# Altium schematic sheet analog_Project_schematic_1.SchDoc
size A4; SheetNumber: 1; SheetTotal: 2
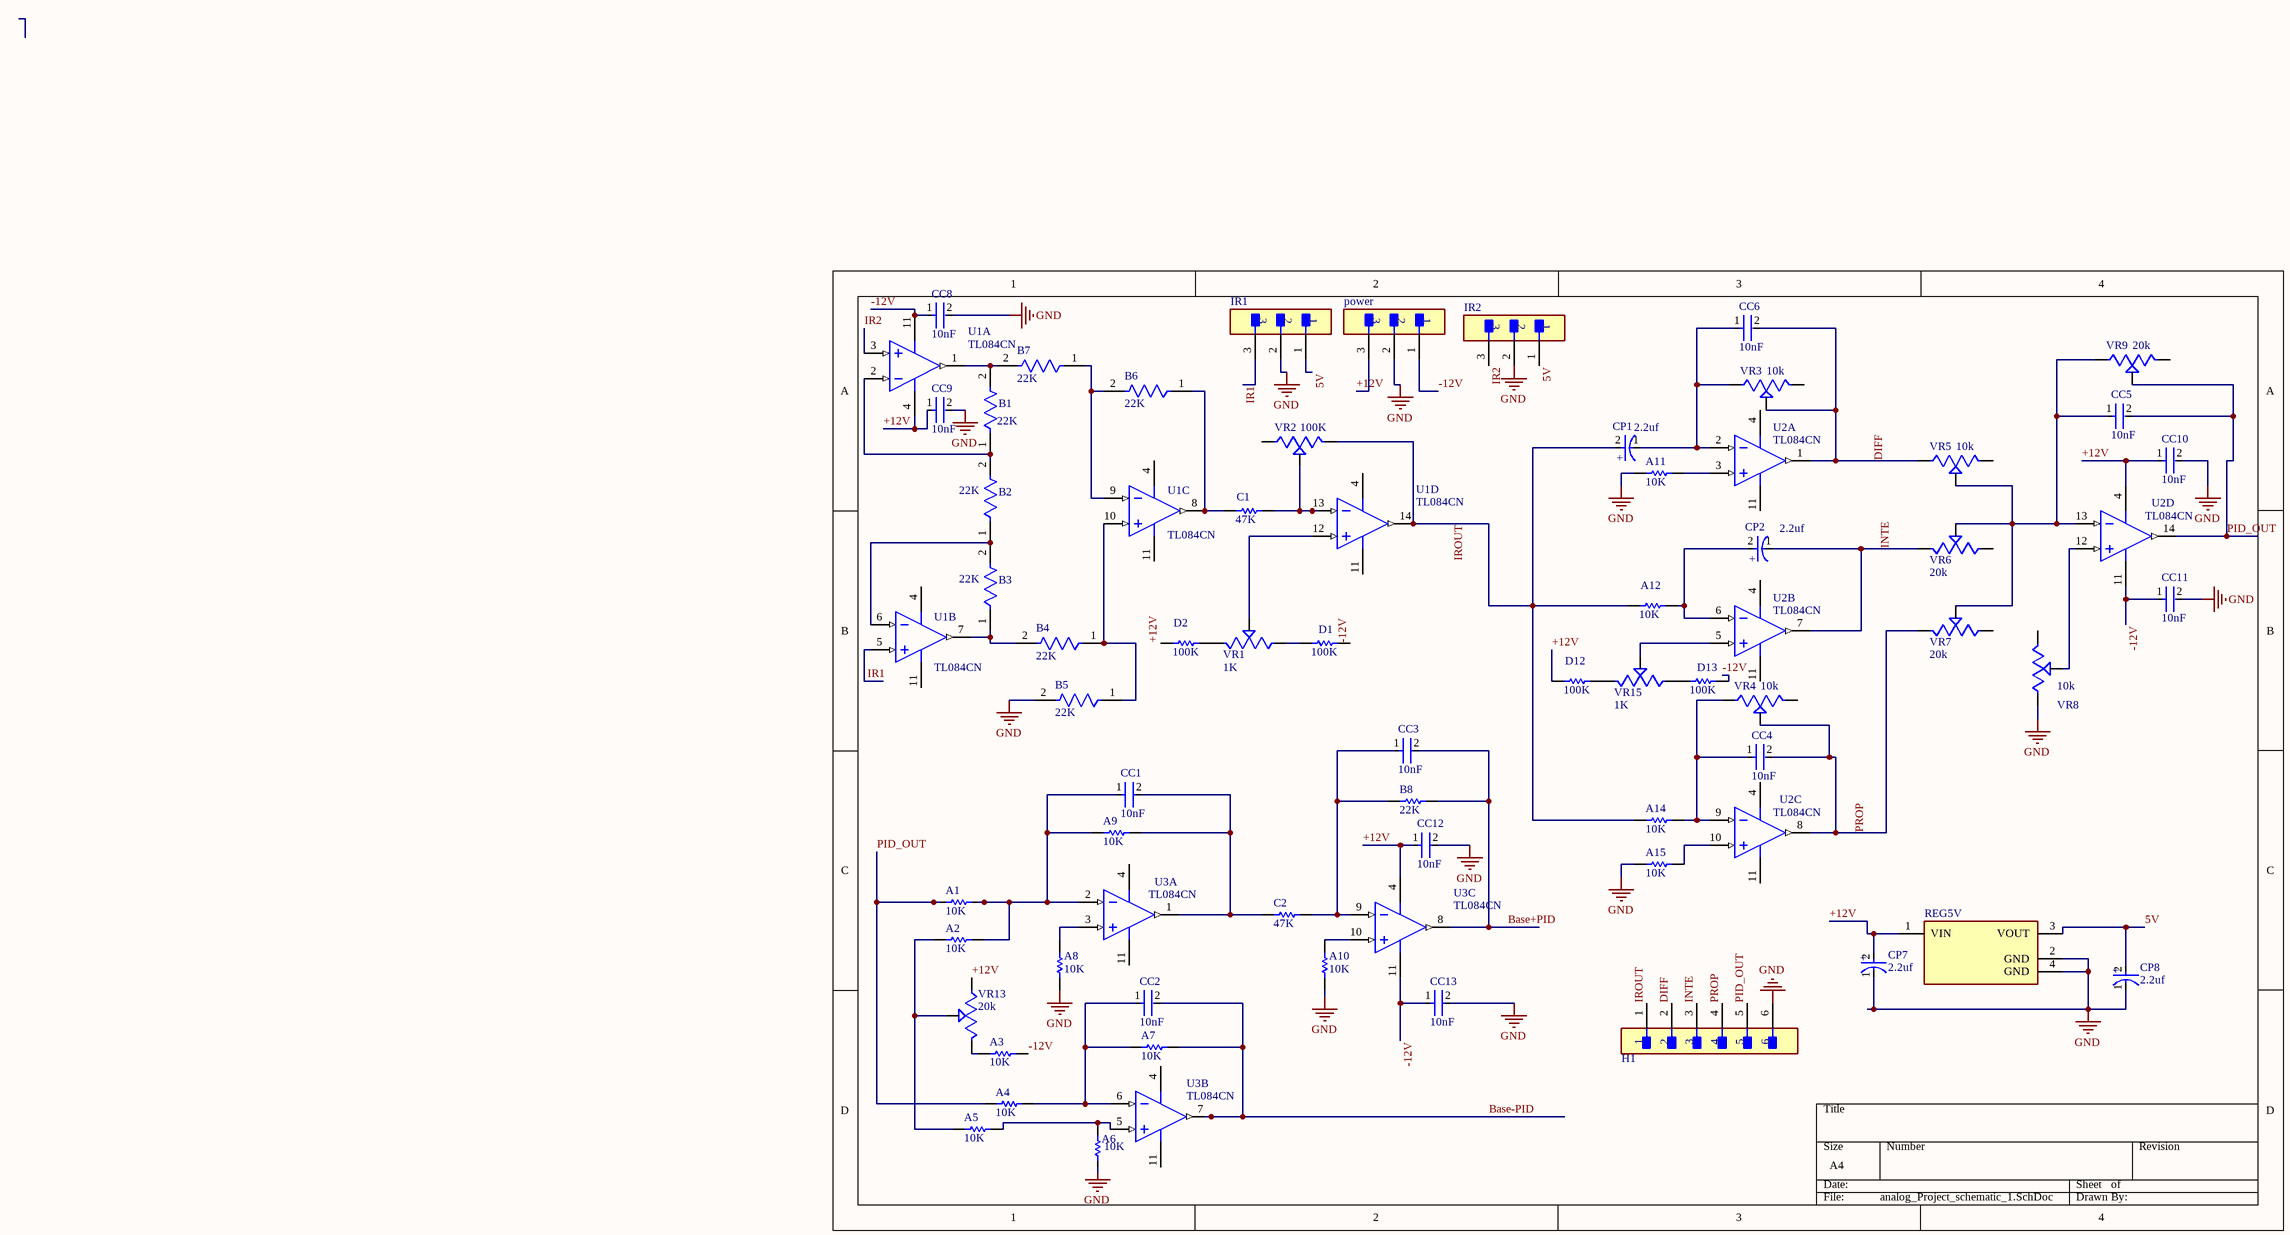
[diagram p0: analog_Project_schematic_1.SchDoc]

## Parts
A1  10K  [RESC3216X70X50NL05T20]
A2  10K  [RESC3216X70X50NL05T20]
A3  10K  [RESC3216X70X50NL05T20]
A4  10K  [RESC3216X70X50NL05T20]
A5  10K  [RESC3216X70X50NL05T20]
A6  10K  [RESC3216X70X50NL05T20]
A7  10K  [RESC3216X70X50NL05T20]
A8  10K  [RESC3216X70X50NL05T20]
A9  10K  [RESC3216X70X50LL05T20]
A10  10K  [RESC3216X70X50NL05T20]
A11  10K  [RESC3216X70X50NL05T20]
A12  10K  [RESC3216X70X50NL05T20]
A14  10K  [RESC3216X70X50NL05T20]
A15  10K  [RESC3216X70X50NL05T20]
B1  22K  [FP-CRCW1206-e3-IPC_A]
B2  22K  [FP-CRCW1206-e3-IPC_A]
B3  22K  [FP-CRCW1206-e3-IPC_A]
B4  22K  [FP-CRCW1206-e3-IPC_A]
B5  22K  [FP-CRCW1206-e3-IPC_A]
B6  22K  [FP-CRCW1206-e3-IPC_A]
B7  22K  [FP-CRCW1206-e3-IPC_A]
B8  22K  [RESC3216X60X45LL10T20]
C1  47K  [RESC3216X60X45LL10T20]
C2  47K  [RESC3216X60X45LL10T20]
CC1  10nF  [FP-C1206C-EB-MFG]
CC2  10nF  [FP-C1206C-EB-MFG]
CC3  10nF  [FP-C1206C-EB-MFG]
CC4  10nF  [FP-C1206C-EB-MFG]
CC5  10nF  [FP-C1206C-EB-MFG]
CC6  10nF  [FP-C1206C-EB-MFG]
CC8  10nF  [FP-C1206C-EB-MFG]
CC9  10nF  [FP-C1206C-EB-MFG]
CC10  10nF  [FP-C1206C-EB-MFG]
CC11  10nF  [FP-C1206C-EB-MFG]
CC12  10nF  [FP-C1206C-EB-MFG]
CC13  10nF  [FP-C1206C-EB-MFG]
CP1  2.2uf  [FP-EEU-FR1H101B-MFG]
CP2  2.2uf  [FP-EEU-FR1H101B-MFG]
CP7  2.2uf  [FP-EEU-FR1H101B-MFG]
CP8  2.2uf  [FP-EEU-FR1H101B-MFG]
D1  100K  [RESC3216X60X45NL10T20]
D2  100K  [RESC3216X60X45NL10T20]
D12  100K  [RESC3216X60X45NL10T20]
D13  100K  [RESC3216X60X45NL10T20]
H1  PEC06SBBN  [FP-PEC06SBBN-MFG]  (value not drawn)
IR1  B3B-XH-A(LF)(SN)  [FP-B3B-XH-A_LF_SN-MFG]  (value not drawn)
IR2  B3B-XH-A(LF)(SN)  [FP-B3B-XH-A_LF_SN-MFG]  (value not drawn)
power  B3B-XH-A(LF)(SN)  [FP-B3B-XH-A_LF_SN-MFG]  (value not drawn)
REG5V  MC33275ST-5.0T3G  [FP-318E-04-IPC_A]  (value not drawn)
U1  TL084CN  [N0014A]  (parts A,B,C,D of 4)
U2  TL084CN  [N0014A]  (parts A,B,C,D of 4)
U3  TL084CN  [N0014A]  (parts A,B,C of 4)
VR1  1K  [TRIM_3296Y-1-104]
VR2  100K  [TRIM_3296Y-1-104]
VR3  10k  [TRIM_3296Y-1-104]
VR4  10k  [TRIM_3296Y-1-104]
VR5  10k  [TRIM_3296Y-1-104]
VR6  20k  [TRIM_3296Y-1-104]
VR7  20k  [TRIM_3296Y-1-104]
VR8  10k  [TRIM_3296Y-1-104]
VR9  20k  [TRIM_3296Y-1-104]
VR13  20k  [TRIM_3296Y-1-104]
VR15  1K  [TRIM_3296Y-1-104]

## Nets
GND: A6.1 A8.1 A10.1 A11.1 A15.1 B5.2 CC8.2 CC9.2 CC10.2 CC11.2 CC12.2 CC13.2 CP7.1(C) CP8.1(C) H1.6 IR1.2 IR2.2 power.2 REG5V.2(GND) REG5V.4(GND) VR8.3(CW)
5V: CP8.2(A) IR1.1 IR2.1 REG5V.3(VOUT)
+12V: CC9.1 CC10.1 CC12.1 CP7.2(A) D2.1 D12.1 power.3 REG5V.1(VIN) U1.4(VCC+) U2.4(VCC+) U3.4(VCC+) VR13.1(CCW)
-12V: A3.2 CC8.1 CC11.1 CC13.1 D1.2 D13.2 power.1 U1.11(VCC-) U2.11(VCC-) U3.11(VCC-)
Base+PID: B8.2 CC3.2 U3.8(OUT3)
Base-PID: A7.2 CC2.2 U3.7(OUT2)
DIFF: CC6.2 H1.2 U2.1(OUT1) VR3.2(WIPER) VR5.3(CW)
INTE: CP2.1(C) H1.3 U2.7(OUT2) VR6.3(CW)
IR1: IR1.3 U1.5(IN2+)
IR2: IR2.3 U1.3(IN1+)
IROUT: A12.1 A14.1 CP1.2(A) H1.1 U1.14(OUT4) VR2.1(CCW)
PID_OUT: A1.1 A4.1 CC5.2 H1.5 U2.14(OUT4) VR9.2(WIPER)
PROP: CC4.2 H1.4 U2.8(OUT3) VR4.2(WIPER) VR7.3(CW)
NetA1_2: A1.2 A2.2 A9.1 CC1.1 U3.2(IN1-)
NetA2_1: A2.1 A5.1 VR13.2(WIPER)
NetA3_1: A3.1 VR13.3(CW)
NetA4_2: A4.2 A7.1 CC2.1 U3.6(IN2-)
NetA5_2: A5.2 A6.2 U3.5(IN2+)
NetA8_2: A8.2 U3.3(IN1+)
NetA9_2: A9.2 C2.1 CC1.2 U3.1(OUT1)
NetA10_2: A10.2 U3.10(IN3+)
NetA11_2: A11.2 U2.3(IN1+)
NetA12_2: A12.2 CP2.2(A) U2.6(IN2-)
NetA14_2: A14.2 CC4.1 U2.9(IN3-) VR4.3(CW)
NetA15_2: A15.2 U2.10(IN3+)
NetB1_1: B1.1 B2.2 U1.2(IN1-)
NetB1_2: B1.2 B7.2 U1.1(OUT1)
NetB2_1: B2.1 B3.2 U1.6(IN2-)
NetB3_1: B3.1 B4.2 U1.7(OUT2)
NetB4_1: B4.1 B5.1 U1.10(IN3+)
NetB6_1: B6.1 C1.1 U1.8(OUT3)
NetB6_2: B6.2 B7.1 U1.9(IN3-)
NetB8_1: B8.1 C2.2 CC3.1 U3.9(IN3-)
NetC1_2: C1.2 U1.13(IN4-) VR2.2(WIPER)
NetCC5_1: CC5.1 U2.13(IN4-) VR5.2(WIPER) VR6.2(WIPER) VR7.2(WIPER) VR9.3(CW)
NetCC6_1: CC6.1 CP1.1(C) U2.2(IN1-) VR3.3(CW)
NetD1_1: D1.1 VR1.3(CW)
NetD2_2: D2.2 VR1.1(CCW)
NetD12_2: D12.2 VR15.1(CCW)
NetD13_1: D13.1 VR15.3(CW)
NetU1_12: U1.12(IN4+) VR1.2(WIPER)
NetU2_5: U2.5(IN2+) VR15.2(WIPER)
NetU2_12: U2.12(IN4+) VR8.2(WIPER)

Not connected (* = marked no-connect by the designer): VR2 3(CW); VR3 1(CCW); VR4 1(CCW); VR5 1(CCW); VR6 1(CCW); VR7 1(CCW); VR8 1(CCW); VR9 1(CCW)

## Notes on the sheet
- (in symbol CMP-05427-000020-1) +

## Library data of the parts
A1-A12 A14 A15 = CMP-2003-00545-1: Part Number: ERJ-8GEYJ103V; Manufacturer: Panasonic
B1-B7 = CMP-2003-01962-2: RES Thick Film, 22kΩ, 1%, 0.25W, 100ppm/°C, 1206; Voltage Rating (DC): 200V; Resistance: 22kR; Max Power Dissipation: 250mW; Lead Free: Lead Free; Length: 3.2mm; Case Code (Imperial): 1206; Max Operating Temperature: 155°C; Packaging: Tape and Reel; Composition: Thick Film; Temperature Coefficient: 100ppm/°C; Contact Plating: Tin; Number of Terminations: 2; Case Code (Metric): 3216; Tolerance: 1%; Weight: 0.000353oz; Features: Automotive AEC-Q200; Min Operating Temperature: -55°C; Width: 0.063inch; Package Quantity: 10; Case/Package: 1206; Termination: SMD/SMT; Military Standard: Not; Depth: 1.6mm; Voltage Rating: 200V; Radiation Hardening: No; Power Rating: 250mW; Height: 0.55mm
B8 C1 C2 = CMP-2003-02213-1: Part Number: CRCW120647K0FKEA; Manufacturer: Vishay Dale
CC1-CC6 CC8-CC13 = CMP-03020-021723-1: Cap Ceramic 0.01uF 100V X7R 10% SMD 1206 125°C Plastic T/R; Manufacturer: KEMET; Manufacturer Part Number: C1206C103K1RACTU; Temperature Coefficient: 15%; Tolerance: 0.1; Capacitance: 10,000 pF; Value: 10,000 pF; Automotive Grade: Grade 0; Device Class L3: Ceramic Capacitors; Ipc Land Pattern Name: CAPC320160X78; Temperature Characteristic: X7R; Material: Ceramic; Category: Cap; Device Class L2: Capacitors; RoHS: TRUE; Mouser Description: Multilayer Ceramic Capacitors MLCC - SMD/SMT 100volts 10000pF X7R 10%; Octopart: https://octopart.com/c1206c103k1ractu-kemet-117927; Temperature: -55°C to +150°C; Temperature Range Low: -55°C; Lead Free: Yes; Automotive: Yes; ComponentLink2URL: https://content.kemet.com/datasheets/KEM_C1007_X8R_ULTRA_150C_SMD.pdf; Package: C1206C-EB; Voltage Rating: 100 V; Temperature Range High: +150°C; ComponentLink2Description: Datasheet; Height: 0.88mm; Device Class L1: Passive Components; Digikey Description: Cap Ceramic 0.01uF 100V X7R 10% SMD 1206 125°C Plastic T/R
CP1 CP2 CP7 CP8 = CMP-05427-000020-1: CAP ALUM 100UF 20% 50V RADIAL; Life (Hours): 6000Hour; Ripple Current: 870mA; Lead Diameter: 0.6mm; Impedance: 61mR; Tolerance: 20%; Mount: Through Hole; Lead Free: Lead Free; Length: 11.5mm; Height - Seated (Max): 0.512inch; Contact Plating: Tin; Termination: Radial; Series: FR; Max Operating Temperature: 105°C; Features: General Purpose; Min Operating Temperature: -40°C; RoHS Compliant: Yes; Height: 11.5mm; Voltage Rating (DC): 50V; Diameter: 8mm; Capacitance: 100uF; Lead Pitch: 5mm; Radiation Hardening: No; Package Quantity: 1; Case/Package: Radial; Voltage Rating: 50V; Packaging: Tape and Reel; ESR (Equivalent Series Resistance): 61mR; REACH SVHC: No SVHC
D1 D2 D12 D13 = CMP-1014-00736-2: Part Number: CRCW1206100KFKEA; Manufacturer: Vishay Dale
H1 = CMP-25680-000045-1: CONN HEADER R/A 6POS 2.54MM; Number of Contacts: 6; Gender: Male; Pitch: 0.1inch; Connector Type: Male Pin; Termination: Solder; Mount: Through Hole; Contact Material: Bronze; RoHS Compliant: Yes; Height: 3.56mm; Number of Rows: 1; Housing Color: Black; Width: 2.54mm; Contact Type: Male Pin; Contact Plating: Tin; Number of Positions: 6; Package Quantity: 1; Length: 15.2mm; Contact Mating Length: 0.23inch; Packaging: Bulk; Lead Free: Lead Free; Housing Material: Plastic; Color: Black
IR1 IR2 power = CMP-17439-000014-3: CONN HEADER VERT 3POS 2.5MM; Max Voltage Rating (DC): 250V; Number of Positions: 3; Current Rating: 3A; Gender: Male; Wire/Cable Gauge: 22AWG; Contact Resistance: 20mR; Insulation Resistance: 1GR; Insulation Material: Nylon; Contact Plating: Tin; Depth: 5.75mm; Contact Type: Male Pin; Max Operating Temperature: 85°C; Insulation Color: Natural; Voltage Rating (AC): 250V; Color: Natural; Connector Type: Header; Orientation: Straight; Fastening Type: Detent; Housing Color: White; Min Operating Temperature: -25°C; Termination: Solder; Voltage Rating: 250V; Series: XH; Pitch: 2.5mm; Contact Shape: Square; Number of Rows: 1; Lead Free: Lead Free; Packaging: Bulk; Mount: Through Hole; Flammability Rating: UL94 V-0; Max Voltage Rating (AC): 250V; REACH SVHC: No SVHC; Housing Material: Polyamide; Contact Material: Brass; Lead Pitch: 2.5mm; Contact Finish - Mating: TIN; Length: 9.9mm; Max Current Rating: 3A; Number of Contacts: 3
REG5V = CMP-07128-000032-1: IC REG LINEAR 5V 300MA SOT223; Accuracy: 1%; Number of Outputs: 1; Quiescent Current: 2mA; Input Bias Current: 1.5mA; Dropout Voltage: 260mV; Min Input Voltage: 6V; Output Type: Fixed; Max Input Voltage: 13V; Polarity: Positive; Radiation Hardening: No; Mount: Surface Mount; Output Current: 300mA; REACH SVHC: No SVHC; Contact Plating: Tin; Max Output Current: 300mA; Output Voltage: 5V; Number of Pins: 3; Width: 6.7mm; Min Output Voltage: 5V; Height: 1.65mm; Min Operating Temperature: -40°C; Package Quantity: 1; Lead Free: Lead Free; Case/Package: SOT-223; Max Operating Temperature: 125°C; Number of Regulators: 1; Current Rating: 300mA; Nominal Output Voltage: 5V; Output Voltage Accuracy: 1%; Length: 6.7mm; Packaging: Tape and Reel; Halogen Free: Halogen Free
U1-U3 = CMP-0017-00818-2: JFET-Input Operational Amplifier, 7 to 36 V, 0 to 70 degC, 14-pin DIP (N14), Pb-Free (RoHS); Manufacturer: Texas Instruments; Rating: Catalog; Iq per channel(Max)(mA): 2.8; Number of Channels: 4; IIB(Max)(pA): 400; Vio (25C)(Max)(mV): 15; GBW(Typ)(MHz): 3; Total Supply Voltage(Max)(+5V is 5, +/-5V is 10): 36; Vn at 1kHz(Typ)(nV/rtHz): 18; Sub Family: General Purpose Amplifier, High Supply Voltage Amplifier (>=30V); Slew Rate(Typ)(V/us): 13; Total Supply Voltage(Min)(+5V is 5, +/-5V is 10): 7; CMRR(Min)(dB): 70; ComponentLink3Description: Package Specification; PackageDescription: 14-Pin Plastic In-Line, Body 19.305 x 6.35 mm, Pitch 2.54 mm; ComponentLink1Description: Manufacturer URL; PackageVersion: 4040049/E, 12/2002; Eco-Plan: Pb-Free (RoHS); ComponentLink2URL: http://www.ti.com/lit/ds/symlink/tl084.pdf; ComponentLink1URL: http://www.ti.com/; DatasheetVersion: SLOS081G; Mounting Technology: Through Hole; PartNumber: TL084CN; Offset Drift(Typ)(uV/C): 18; PackageReference: N0014A; ComponentLink3URL: http://www.ti.com/lit/ml/mpdi002c/mpdi002c.pdf; ComponentLink2Description: Datasheet; Code_JEDEC: MS-001
VR1-VR9 VR13 VR15 = 3296Y-1-104: Price: None; MP: 3296Y-1-104; Availability: Unavailable; Package: None; Value: *